# EAGLE design rgb-led (EAGLE 7.6.0)
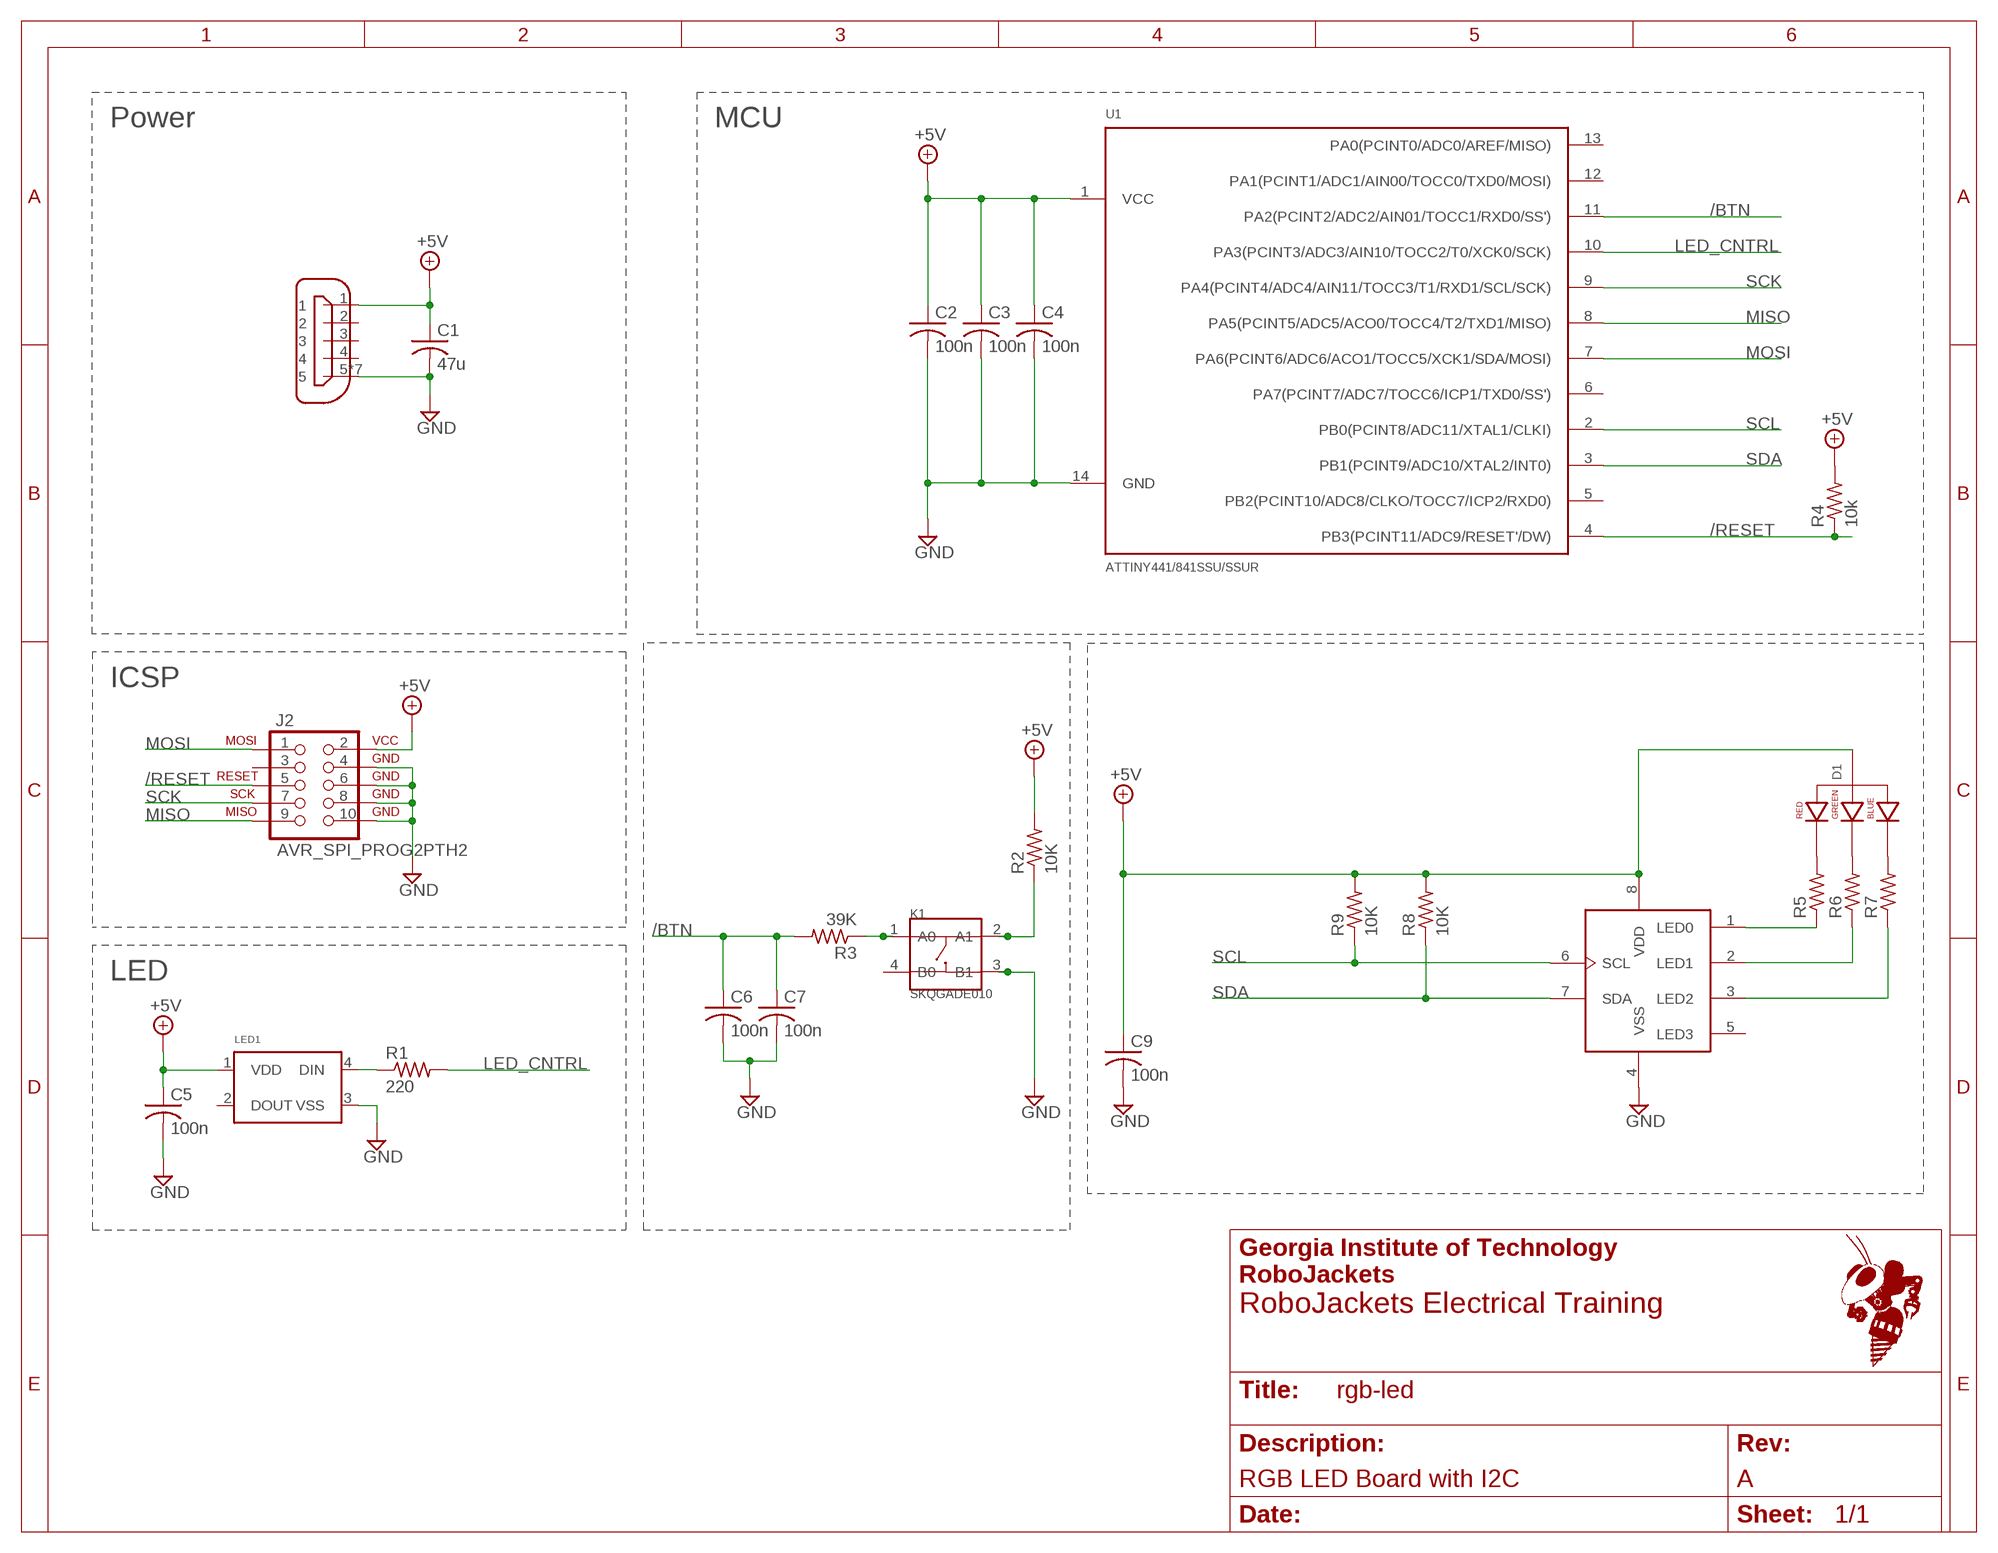
[diagram p0: schematic, sheet 1]
FRAME1 (FRAME_A_L): REVISION: A; SCH_DESC: RGB LED Board with I2C; TEAM: RoboJackets Electrical Training

## Parts
C1  47u  C-USC1206  [C1206]
C2  100n  C-USC0603  [C0603]
C3  100n  C-USC0603  [C0603]
C4  100n  C-USC0603  [C0603]
C5  100n  C-USC0603  [C0603]
C6  100n  C-USC0603  [C0603]
C7  100n  C-USC0603  [C0603]
C9  100n  C-USC0603  [C0603]
D1  LED-RGB-CA-THRUCLEAR  [LED-RGB-THRU]
J1  MICRO-USB  [GS-14-2180]
J2  AVR_SPI_PROG2PTH2  [2X5-SHROUDED]
K1  SKQGADE010  SMD-SWITCH-TOP-260GF(4P-D5.2MM)  [SW4-SMD-5.2X5.2X1.5MM]
LED1  WS2812B  [5050]
R1  220  R-US_R0603  [R0603]
R2  10K  R-US_R0603  [R0603]
R3  39K  R-US_R0805  [R0805]
R4  10k  R-US_R0603  [R0603]
R5  R-US_R0603  [R0603]
R6  R-US_R0603  [R0603]
R7  R-US_R0603  [R0603]
R8  10K  R-US_R0603  [R0603]
R9  10K  R-US_R0603  [R0603]
U1  ATTINY441/841SSU/SSUR  [SOIC-14]
U2  PCA9533  [SOIC8]

## Nets
+5V [PWR]: C1.1 C2.1 C3.1 C4.1 C5.1 C9.1 D1.2(ANODE) J1.1 J2.2(VCC) LED1.1(VDD) R2.2 R4.2 R8.2 R9.2 U1.1(VCC) U2.8(VDD)
/BTN: C6.1 C7.1 R3.2 U1.11(PA2(PCINT2/ADC2/AIN01/TOCC1/RXD0/SS'))
/RESET: J2.5(RESET) R4.1 U1.4(PB3(PCINT11/ADC9/RESET'/DW))
GND: C1.2 C2.2 C3.2 C4.2 C5.2 C6.2 C7.2 C9.2 J1.5 J1.5@1 J1.5@2 J1.5@3 J1.5@4 J1.5@6 J1.5@7 J2.4(GND) J2.6(GND) J2.8(GND) J2.10(GND) K1.3(B1) LED1.3(VSS) U1.14(GND) U2.4(VSS)
LED_CNTRL: R1.2 U1.10(PA3(PCINT3/ADC3/AIN10/TOCC2/T0/XCK0/SCK))
MISO: J2.9(MISO) U1.8(PA5(PCINT5/ADC5/ACO0/TOCC4/T2/TXD1/MISO))
MOSI: J2.1(MOSI) U1.7(PA6(PCINT6/ADC6/ACO1/TOCC5/XCK1/SDA/MOSI))
N$1: LED1.4(DIN) R1.1
N$2: K1.2(A1) R2.1
N$3: K1.1(A0) R3.1
N$6: D1.1(RED_CATHODE) R5.2
N$9: D1.3(GREEN_CATHODE) R6.2
N$10: D1.4(BLUE_CATHODE) R7.2
N$11: R5.1 U2.1(LED0)
N$12: R6.1 U2.2(LED1)
N$13: R7.1 U2.3(LED2)
SCK: J2.7(SCK) U1.9(PA4(PCINT4/ADC4/AIN11/TOCC3/T1/RXD1/SCL/SCK))
SCL: R9.1 U1.2(PB0(PCINT8/ADC11/XTAL1/CLKI)) U2.6(SCL)
SDA: R8.1 U1.3(PB1(PCINT9/ADC10/XTAL2/INT0)) U2.7(SDA)
Unconnected: J1.2 J1.3 J1.4 J2.3(NC) K1.4(B0) LED1.2(DOUT) U1.5(PB2(PCINT10/ADC8/CLKO/TOCC7/ICP2/RXD0)) U1.6(PA7(PCINT7/ADC7/TOCC6/ICP1/TXD0/SS')) U1.12(PA1(PCINT1/ADC1/AIN00/TOCC0/TXD0/MOSI)) U1.13(PA0(PCINT0/ADC0/AREF/MISO)) U2.5(LED3)

## Notes on the sheet
- Power | MCU
- ICSP
- LED

## Library data of the parts
C1-C7 C9 = rcl:C-US: CAPACITOR, American symbol; OC_NEWARK: unknown
D1 = rgb-led:LED-RGB-CA-THRU: RGB Through-hole common anode SparkFun store front COM-10821 (diffuse) COM-10820 (clear); OC_NEWARK: unknown; PROD_ID: DIO-10631
J1 = rgb-led:MICRO-USB; MPN: 10104110-0001LF; OC_NEWARK: 82R7424
J2 = rgb-led:AVR_SPI_PROG2: AVR 10-pin ICSP Header This is the standard AVR In Circuit Serial Programming header. Minimal, but includes pin one indicator. Works with standard Olimex programmers. Also look for the 6-pin reduced version. Spark Fun Electronics SKU: PRT-00778; OC_NEWARK: unknown
K1 = rgb-led:SMD-SWITCH-TOP-260GF(4P-D5.2MM): 311020017; OC_NEWARK: unknown
LED1 = rgb-led:WS2812B: WS2812B 5050 RGB LED with Integrated Driver Chip http://www.adafruit.com/products/1655; OC_NEWARK: unknown
R1 = rcl:R-US_: RESISTOR, American symbol; OC_NEWARK: unknown
R2 R8 R9 = resistor:R-US_: RESISTOR, American symbol; MF: FARNELL; MPN: MCF 0.25W 10K; OC_NEWARK: 38K0328
R3-R7 = resistor:R-US_: RESISTOR, American symbol; OC_NEWARK: unknown
U1 = rgb-led:ATTINY441/841; OC_NEWARK: unknown
U2 = rgb-led:PCA9533: PCA9533D/01: LED driver and dimmer 4 channel, PWM @ 8 bit resolution 25mA / channel sink external resistors per LED I2C protocol @ 400kHz (fast) digikey: 568-3372-5-ND, 8-SOIC, $1.92; MPN: PCA9533DP/01,118; OC_NEWARK: 70R6524

## Net classes
0 default: width 0.203 mm
1 PWR: width 0.254 mm

## Board
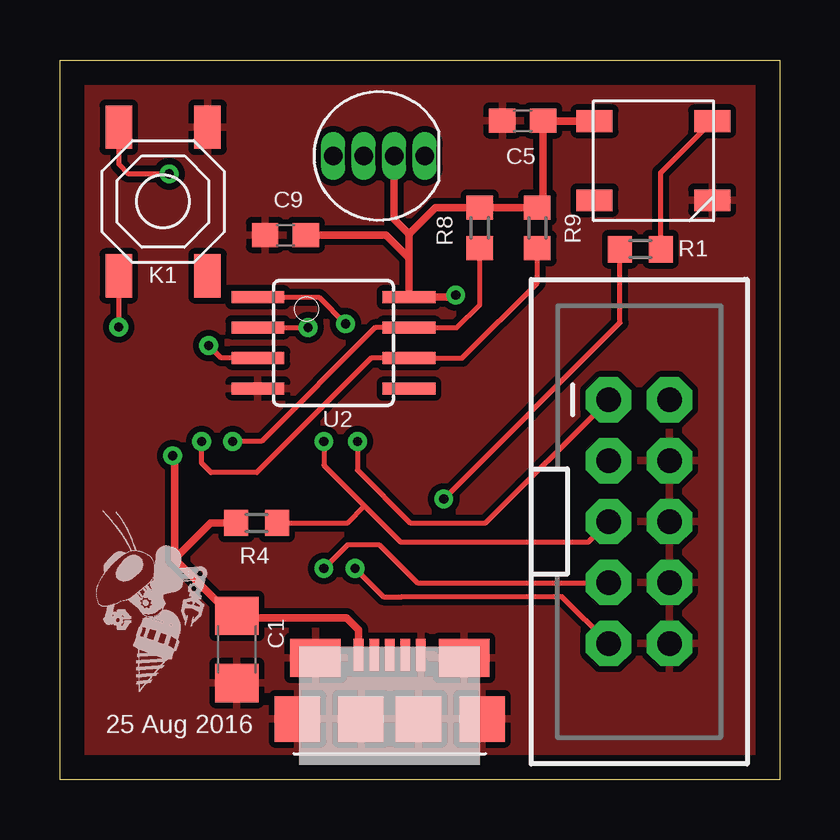
[diagram p1: board, top side]
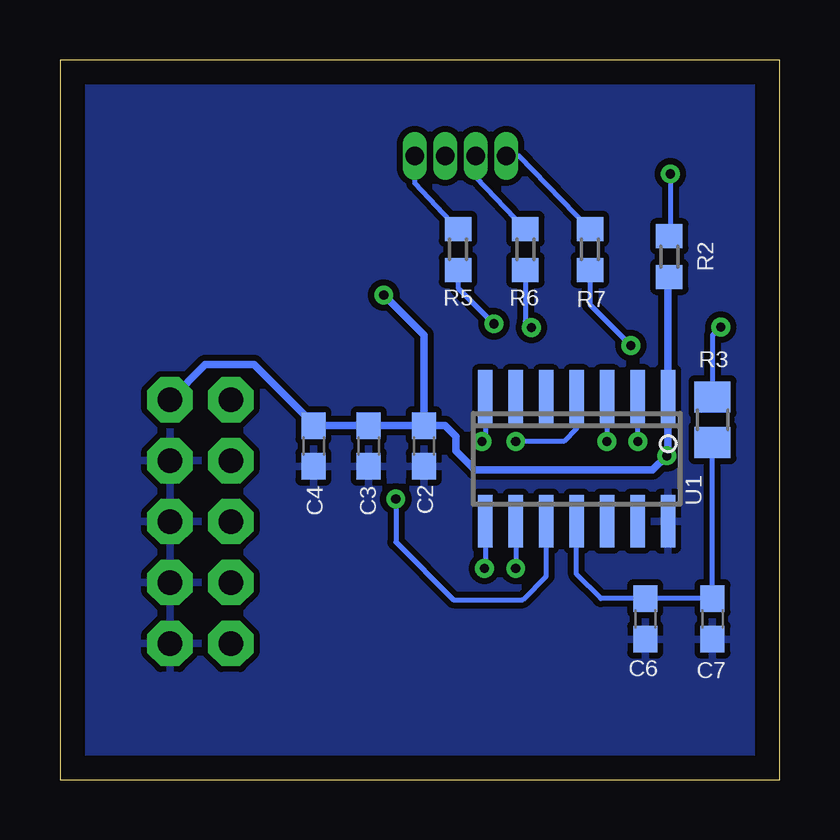
[diagram p2: board, bottom side, seen from below]

Size 30 x 30 mm. Coordinates in mm from the lower left corner, seen from the top.
Outline: 0,0 0,30 30,30 30,0 0,0
Copper layers (1*16): Top 0.035mm / dielectric 1.5mm / Bottom 0.035mm
Design rules "default *": minimum track width 8mil, minimum drill 15mil, track to track 8mil, track to pad 8mil, pad to pad 8mil, via to via 8mil, smd to smd 8mil, copper to edge 40mil, drill to drill 8mil, minimum pad ring 0mil, minimum via ring 8mil, stop-mask expansion 4mil, vias tented up to drill 0mil, thermal gap 10mil

### Footprints (pad centres in the part's own frame; a part is rotated, then mirrored left to right if it is on the bottom)
C1206 = smd 1.6 x 1.8: 1 -1.4,0; 2 1.4,0
C0603 = smd 1.1 x 1: 1 -0.85,0; 2 0.85,0
LED-RGB-THRU = drill 0.762 pad 0.889 long: 1 1.905,0; 2 0.635,0; 3 -0.635,0; 4 -1.905,0
GS-14-2180 = smd 0.4 x 1.35: 1 -1.3,2.675; 2 -0.65,2.675; 3 0,2.675; 4 0.65,2.675; 5 1.3,2.675 | smd 2.1 x 1.6: 5@1 3.1,2.55; 5@7 -3.1,2.55 | smd 1.9 x 1.9: 5@2 3.85,0; 5@3 1.2,0; 5@4 -1.2,0; 5@6 -3.85,0
2X5-SHROUDED = drill 1.016 pad 1.88 octagon: 1 -1.27,5.08; 2 1.27,5.08; 3 -1.27,2.54; 4 1.27,2.54; 5 -1.27,0; 6 1.27,0; 7 -1.27,-2.54; 8 1.27,-2.54; 9 -1.27,-5.08; 10 1.27,-5.08
SW4-SMD-5.2X5.2X1.5MM = smd 1.8 x 1.1: 1 -3.1,1.85; 2 3.1,1.85; 3 3.1,-1.85; 4 -3.1,-1.85
5050 = smd 1.5 x 0.9: 1 -2.45,1.65; 2 -2.45,-1.65; 3 2.45,-1.65; 4 2.45,1.65
R0603 = smd 1 x 1.1: 1 -0.85,0; 2 0.85,0
R0805 = smd 1.3 x 1.5: 1 -0.95,0; 2 0.95,0
SOIC-14 = smd 0.6 x 2.2: 1 -3.81,-2.6; 2 -2.54,-2.6; 3 -1.27,-2.6; 4 0,-2.6; 5 1.27,-2.6; 6 2.54,-2.6; 7 3.81,-2.6; 8 3.81,2.6; 9 2.54,2.6; 10 1.27,2.6; 11 0,2.6; 12 -1.27,2.6; 13 -2.54,2.6; 14 -3.81,2.6
SOIC8 = smd 0.5 x 2.2: 1 -1.905,-3.154; 2 -0.645,-3.154; 3 0.625,-3.154; 4 1.895,-3.154; 5 1.905,3.154; 6 0.635,3.154; 7 -0.635,3.154; 8 -1.905,3.154

### Placement (x,y rotation side)
C1  7.37,5.42 270 top
C2  14.83,13.9 270 bottom
C3  17.13,13.9 270 bottom
C4  19.43,13.9 270 bottom
C5  19.29,27.47 180 top
C6  5.6,6.7 270 bottom
C7  2.8,6.7 270 bottom
C9  9.4,22.7 180 top
D1  13.3,26 0 top
J1  13.75,2.52 0 top
J2  24.15,10.75 0 top
K1  4.3,24.1 90 top
LED1  24.74,25.8 0 top
R1  24.2,22.11 180 top
R2  4.6,21.8 270 bottom
R3  2.8,15 270 bottom
R4  8.2,10.7 180 top
R5  13.4,22.1 90 bottom
R6  10.6,22.1 90 bottom
R7  7.9,22.1 90 bottom
R8  17.5,23 90 top
R9  19.9,23 90 top
U1  8.46,13.37 180 bottom
U2  11.4,18.2 270 top
U$2  [ROBOBUZZ_0.4X]  3.28,3.66 0 top

### Tracks (layer width: path | path; a pad name or v marks a point on that pad's centre or on a via)
+5V  (via drill 0.38)
  Top 0.305: 14.55,21.74 U2.8 16.41,20.11 v16.5,20.2 | 14.55,21.74 14.55,22.75 | LED1.1 20.16,27.45 C5.1 20.14,24.19 R9.2 R8.2 15.66,23.85 14.55,22.75 | C9.1 13.59,22.7 14.55,21.74 | 4.79,9.2 4.79,13.11 v4.7,13.5 | R4.2 6.29,10.7 4.79,9.2 | J1.1 12.45,6.23 11.94,6.74 7.46,6.74 C1.1 6.96,6.74 6.96,7.03 4.79,9.2 | 14.55,22.75 13.94,23.36 D1.2
  Bottom 0.305: R2.2 4.65,20.8 U1.1 4.65,13.55 v4.7,13.5 5.3,12.9 12.7,12.9 13.5,13.7 13.5,14.3 13.96,14.76 C2.1 | J2.2 23.95,17.3 21.9,17.3 19.43,14.83 | 19.43,14.83 C4.1 | 19.43,14.83 19.36,14.76 C3.1 C2.1 | C2.1 14.83,18.53 v16.5,20.2
/BTN
  Bottom 0.203: R3.2 C7.1 C6.1 7.45,7.55 8.46,8.56 U1.11
/RESET  (via drill 0.38)
  Top 0.203: v11,14.1 11,13.1 12.7,11.4 | 12.7,11.4 14.2,9.9 22.02,9.9 J2.5 | R4.1 12,10.7 12.7,11.4
  Bottom 0.203: U1.4 8.46,14.64 9,14.1 v11,14.1
GND
  pour Top (isolate 0.254): 0.6,0.45 0.6,29.3 29.35,29.3 29.35,0.45
  pour Bottom (isolate 0.254): 0.6,0.45 0.6,29.3 29.35,29.3 29.35,0.45
LED_CNTRL  (via drill 0.38)
  Top 0.203: v16,11.7 23.35,19.05 R1.2
  Bottom 0.203: U1.10 9.73,8.47 10.7,7.5 13.6,7.5 16,9.9 v16,11.7
MISO  (via drill 0.38)
  Top 0.203: J2.9 20.93,7.62 14.77,7.62 14.26,7.62 13.48,7.62 v12.3,8.8
  Bottom 0.203: U1.8 12.27,8.83 v12.3,8.8
MOSI  (via drill 0.38)
  Top 0.203: 22.83,15.88 J2.1 17.74,10.7 14.6,10.7 12.4,12.9 v12.4,14.1
  Bottom 0.203: U1.7 12.27,14.23 v12.4,14.1
N$1
  Top 0.203: R1.1 25.05,25.31 LED1.4
N$2  (via drill 0.38)
  Top 0.203: K1.2 2.45,25.65 2.85,25.25 v4.55,25.25
  Bottom 0.203: v4.55,25.25 4.55,22.8 R2.1
N$3  (via drill 0.38)
  Top 0.203: K1.1 v2.45,18.87
  Bottom 0.203: v2.45,18.87 2.8,18.52 R3.1
N$6
  Bottom 0.203: R5.2 15.21,24.86 D1.1
N$9
  Bottom 0.203: R6.2 12.66,25.11 D1.3
N$10
  Bottom 0.203: R7.2 10.85,26 D1.4
N$11  (via drill 0.38)
  Top 0.203: U2.1 10.79,20.11 v11.9,19
  Bottom 0.203: R5.1 13.4,20.5 v11.9,19
N$12  (via drill 0.38)
  Top 0.203: U2.2 v10.35,18.84 v10.35,18.85
  Bottom 0.203: R6.1 10.6,19.1 v10.35,18.85
N$13  (via drill 0.38)
  Top 0.203: U2.3 6.72,17.57 v6.2,18.1
  Bottom 0.203: R7.1 7.9,19.8 v6.2,18.1
SCK  (via drill 0.38)
  Top 0.203: v11,8.8 12,9.8 13.3,9.8 14.9,8.2 22.86,8.2 J2.7
  Bottom 0.203: U1.9 v11,8.8
SCL  (via drill 0.38)
  Top 0.203: v5.9,14.1 5.9,13.2 6.3,12.8 8.2,12.8 12.96,17.57 U2.6 16.77,17.57 19.9,20.7 R9.1
  Bottom 0.203: U1.2 5.92,14.12 v5.9,14.1
SDA  (via drill 0.38)
  Top 0.203: v7.2,14.1 8.4,14.1 13.13,18.84 U2.7 16.54,18.84 17.5,19.8 R8.1
  Bottom 0.203: U1.3 v7.19,14.11 v7.2,14.1

### Text on the board
tNames: 25 Aug 2016